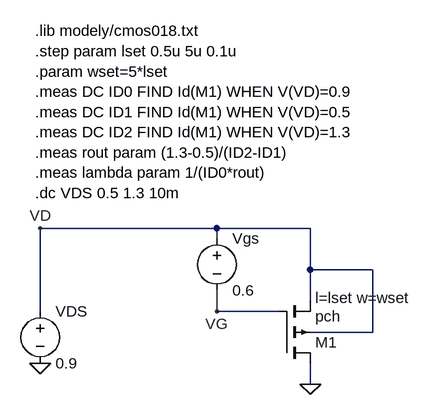
[diagram p0: schematic P4-mos.asc]
P4-mos.asc, the LTspice schematic file:
Version 4
SHEET 1 880 680
WIRE 80 64 -192 64
WIRE 224 64 80 64
WIRE 80 80 80 64
WIRE 224 128 224 64
WIRE 320 128 224 128
WIRE 224 176 224 128
WIRE -192 192 -192 64
WIRE 80 192 80 160
WIRE 176 192 80 192
WIRE 320 224 320 128
WIRE 320 224 224 224
WIRE 224 304 224 272
FLAG 224 304 0
FLAG -192 272 0
FLAG -192 64 VD
FLAG 80 192 VG
SYMBOL voltage 80 64 R0
WINDOW 123 0 0 Left 0
WINDOW 39 0 0 Left 0
SYMATTR InstName Vgs
SYMATTR Value 0.6
SYMBOL voltage -192 176 R0
WINDOW 123 0 0 Left 0
WINDOW 39 0 0 Left 0
SYMATTR InstName VDS
SYMATTR Value 0.9
SYMBOL pmos4 176 272 M180
WINDOW 123 56 101 Left 2
SYMATTR Value2 l=lset w=wset
SYMATTR InstName M1
SYMATTR Value pch
TEXT -200 -240 Left 2 !.lib modely/cmos018.txt\n.step param lset 0.5u 5u 0.1u\n.param wset=5*lset\n.meas DC ID0 FIND Id(M1) WHEN V(VD)=0.9\n.meas DC ID1 FIND Id(M1) WHEN V(VD)=0.5\n.meas DC ID2 FIND Id(M1) WHEN V(VD)=1.3\n.meas rout param (1.3-0.5)/(ID2-ID1)\n.meas lambda param 1/(ID0*rout)\n.dc VDS 0.5 1.3 10m

The netlist it stands for:
* P4-mos.asc
Vgs VD VG 0.6
VDS VD 0 0.9
M1 0 VG VD VD pch l=lset w=wset
.model NMOS NMOS
.model PMOS PMOS
.lib standard.mos
.lib modely/cmos018.txt
.step param lset 0.5u 5u 0.1u
.param wset=5*lset
.meas DC ID0 FIND Id(M1) WHEN V(VD)=0.9
.meas DC ID1 FIND Id(M1) WHEN V(VD)=0.5
.meas DC ID2 FIND Id(M1) WHEN V(VD)=1.3
.meas rout param (1.3-0.5)/(ID2-ID1)
.meas lambda param 1/(ID0*rout)
.dc VDS 0.5 1.3 10m
.backanno
.end

* Results of the author's LTspice run, read from the files saved beside the schematic
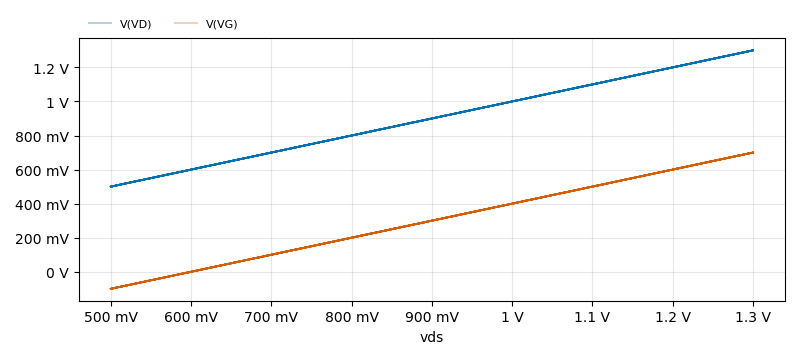
[diagram p1: DC transfer characteristic of P4-mos.asc, plotted from the saved traces]
* DC transfer characteristic, 46 runs:
*   V(VD) [run 1]: 500 mV at vds=500 mV, 1.3 V at vds=1.3 V, min 500 mV, max 1.3 V
*   V(VD) [run 2]: 500 mV at vds=500 mV, 1.3 V at vds=1.3 V, min 500 mV, max 1.3 V
*   V(VD) [run 3]: 500 mV at vds=500 mV, 1.3 V at vds=1.3 V, min 500 mV, max 1.3 V
*   V(VD) [run 4]: 500 mV at vds=500 mV, 1.3 V at vds=1.3 V, min 500 mV, max 1.3 V
*   V(VD) [run 5]: 500 mV at vds=500 mV, 1.3 V at vds=1.3 V, min 500 mV, max 1.3 V
*   V(VD) [run 6]: 500 mV at vds=500 mV, 1.3 V at vds=1.3 V, min 500 mV, max 1.3 V
*   V(VD) [run 7]: 500 mV at vds=500 mV, 1.3 V at vds=1.3 V, min 500 mV, max 1.3 V
*   V(VD) [run 8]: 500 mV at vds=500 mV, 1.3 V at vds=1.3 V, min 500 mV, max 1.3 V
*   V(VG) [run 1]: -100 mV at vds=500 mV, 700 mV at vds=1.3 V, min -100 mV, max 700 mV
*   V(VG) [run 2]: -100 mV at vds=500 mV, 700 mV at vds=1.3 V, min -100 mV, max 700 mV
*   V(VG) [run 3]: -100 mV at vds=500 mV, 700 mV at vds=1.3 V, min -100 mV, max 700 mV
*   V(VG) [run 4]: -100 mV at vds=500 mV, 700 mV at vds=1.3 V, min -100 mV, max 700 mV
*   V(VG) [run 5]: -100 mV at vds=500 mV, 700 mV at vds=1.3 V, min -100 mV, max 700 mV
*   V(VG) [run 6]: -100 mV at vds=500 mV, 700 mV at vds=1.3 V, min -100 mV, max 700 mV
*   V(VG) [run 7]: -100 mV at vds=500 mV, 700 mV at vds=1.3 V, min -100 mV, max 700 mV
*   V(VG) [run 8]: -100 mV at vds=500 mV, 700 mV at vds=1.3 V, min -100 mV, max 700 mV
* From the log:
*   Measurement: id0
*     step  id(m1)  at
*        1  -4.54549e-06  0.9
*        2  -4.68244e-06  0.9
*        3  -4.81585e-06  0.9
*        4  -4.93808e-06  0.9
*        5  -5.0471e-06  0.9
*        6  -5.14319e-06  0.9
*        7  -5.22749e-06  0.9
*        8  -5.30135e-06  0.9
*        9  -5.36616e-06  0.9
*       10  -5.42317e-06  0.9
*       11  -5.47348e-06  0.9
*       12  -5.51806e-06  0.9
*       13  -5.55771e-06  0.9
*       14  -5.59314e-06  0.9
*       15  -5.62494e-06  0.9
*       16  -5.65358e-06  0.9
*       17  -5.6795e-06  0.9
*       18  -5.70304e-06  0.9
*       19  -5.7245e-06  0.9
*       20  -5.74412e-06  0.9
*       21  -5.76213e-06  0.9
*       22  -5.77871e-06  0.9
*       23  -5.79401e-06  0.9
*       24  -5.80817e-06  0.9
*       25  -5.8213e-06  0.9
*       26  -5.83352e-06  0.9
*       27  -5.8449e-06  0.9
*       28  -5.85553e-06  0.9
*       29  -5.86547e-06  0.9
*       30  -5.87478e-06  0.9
*       31  -5.88353e-06  0.9
*       32  -5.89175e-06  0.9
*       33  -5.89949e-06  0.9
*       34  -5.90679e-06  0.9
*       35  -5.91368e-06  0.9
*       36  -5.92019e-06  0.9
*       37  -5.92635e-06  0.9
*       38  -5.93219e-06  0.9
*       39  -5.93772e-06  0.9
*       40  -5.94298e-06  0.9
*     ...
*   Measurement: id1
*     step  id(m1)  at
*        1  -4.18461e-06  0.5
*        2  -4.35407e-06  0.5
*        3  -4.51199e-06  0.5
*        4  -4.65379e-06  0.5
*        5  -4.77902e-06  0.5
*        6  -4.88888e-06  0.5
*        7  -4.98509e-06  0.5
*        8  -5.06942e-06  0.5
*        9  -5.1435e-06  0.5
*       10  -5.20881e-06  0.5
*       11  -5.26661e-06  0.5
*       12  -5.31797e-06  0.5
*       13  -5.36382e-06  0.5
*       14  -5.40492e-06  0.5
*       15  -5.44193e-06  0.5
*       16  -5.4754e-06  0.5
*       17  -5.50579e-06  0.5
*       18  -5.53349e-06  0.5
*       19  -5.55882e-06  0.5
*       20  -5.58208e-06  0.5
*       21  -5.60349e-06  0.5
*       22  -5.62327e-06  0.5
*       23  -5.64159e-06  0.5
*       24  -5.6586e-06  0.5
*       25  -5.67443e-06  0.5
*       26  -5.6892e-06  0.5
*       27  -5.70302e-06  0.5
*       28  -5.71596e-06  0.5
*       29  -5.72811e-06  0.5
*       30  -5.73953e-06  0.5
*       31  -5.75029e-06  0.5
*       32  -5.76044e-06  0.5
*       33  -5.77003e-06  0.5
*       34  -5.7791e-06  0.5
*       35  -5.7877e-06  0.5
*       36  -5.79585e-06  0.5
*       37  -5.8036e-06  0.5
*       38  -5.81096e-06  0.5
*       39  -5.81797e-06  0.5
*       40  -5.82465e-06  0.5
*     ...
*   Measurement: id2
*     step  id(m1)  at
*        1  -4.91176e-06  1.3
*        2  -5.01542e-06  1.3
*        3  -5.12362e-06  1.3
*        4  -5.22569e-06  1.3
*        5  -5.318e-06  1.3
*        6  -5.39987e-06  1.3
*        7  -5.47186e-06  1.3
*        8  -5.53493e-06  1.3
*        9  -5.59016e-06  1.3
*       10  -5.63859e-06  1.3
*       11  -5.68117e-06  1.3
*       12  -5.71874e-06  1.3
*       13  -5.75201e-06  1.3
*       14  -5.78159e-06  1.3
*       15  -5.80799e-06  1.3
*       16  -5.83167e-06  1.3
*       17  -5.85298e-06  1.3
*       18  -5.87223e-06  1.3
*       19  -5.88969e-06  1.3
*       20  -5.90557e-06  1.3
*       21  -5.92008e-06  1.3
*       22  -5.93336e-06  1.3
*       23  -5.94555e-06  1.3
*       24  -5.95677e-06  1.3
*       25  -5.96713e-06  1.3
*       26  -5.97671e-06  1.3
*       27  -5.98559e-06  1.3
*       28  -5.99384e-06  1.3
*       29  -6.00151e-06  1.3
*       30  -6.00866e-06  1.3
*       31  -6.01533e-06  1.3
*       32  -6.02157e-06  1.3
*       33  -6.02741e-06  1.3
*       34  -6.03289e-06  1.3
*       35  -6.03802e-06  1.3
*       36  -6.04285e-06  1.3
*       37  -6.04738e-06  1.3
*       38  -6.05165e-06  1.3
*       39  -6.05568e-06  1.3
*       40  -6.05947e-06  1.3
*     ...
*   Measurement: rout
*     step  (1.3-0.5)/(id2-id1)
*        1  -1.10018e+06
*        2  -1.20964e+06
*        3  -1.30799e+06
*        4  -1.39884e+06
*        5  -1.48429e+06
*        6  -1.56558e+06
*        7  -1.64349e+06
*        8  -1.71854e+06
*        9  -1.7911e+06
*       10  -1.86143e+06
*       11  -1.92973e+06
*       12  -1.99616e+06
*       13  -2.06084e+06
*       14  -2.1239e+06
*       15  -2.18543e+06
*       16  -2.24552e+06
*       17  -2.30424e+06
*       18  -2.36168e+06
*       19  -2.41791e+06
*       20  -2.47299e+06
*       21  -2.52698e+06
*       22  -2.57994e+06
*       23  -2.63193e+06
*       24  -2.683e+06
*       25  -2.73318e+06
*       26  -2.78254e+06
*       27  -2.83112e+06
*       28  -2.87895e+06
*       29  -2.92607e+06
*       30  -2.97252e+06
*       31  -3.01834e+06
*       32  -3.06354e+06
*       33  -3.10818e+06
*       34  -3.15228e+06
*       35  -3.19584e+06
*       36  -3.23893e+06
*       37  -3.28154e+06
*       38  -3.32371e+06
*       39  -3.36545e+06
*       40  -3.4068e+06
*     ...
*   Measurement: lambda
*     step  1/(id0*rout)
*        1  0.199966
*        2  0.176552
*        3  0.158754
*        4  0.144768
*        5  0.133487
*        6  0.124192
*        7  0.116397
*        8  0.109762
*        9  0.104044
*       10  0.0990602
*       11  0.0946759
*       12  0.090786
*       13  0.087309
*       14  0.0841801
*       15  0.0813478
*       16  0.0787698
*       17  0.0764121
*       18  0.0742459
*       19  0.0722475
*       20  0.070397
*       21  0.0686775
*       22  0.0670749
*       23  0.0655763
*       24  0.0641713
*       25  0.0628509
*       26  0.0616067
*       27  0.0604318
*       28  0.0593199
*       29  0.0582657
*       30  0.0572642
*       31  0.0563112
*       32  0.0554028
*       33  0.0545355
*       34  0.0537062
*       35  0.0529124
*       36  0.052151
*       37  0.0514204
*       38  0.0507179
*       39  0.0500423
*       40  0.0493912
*     ...